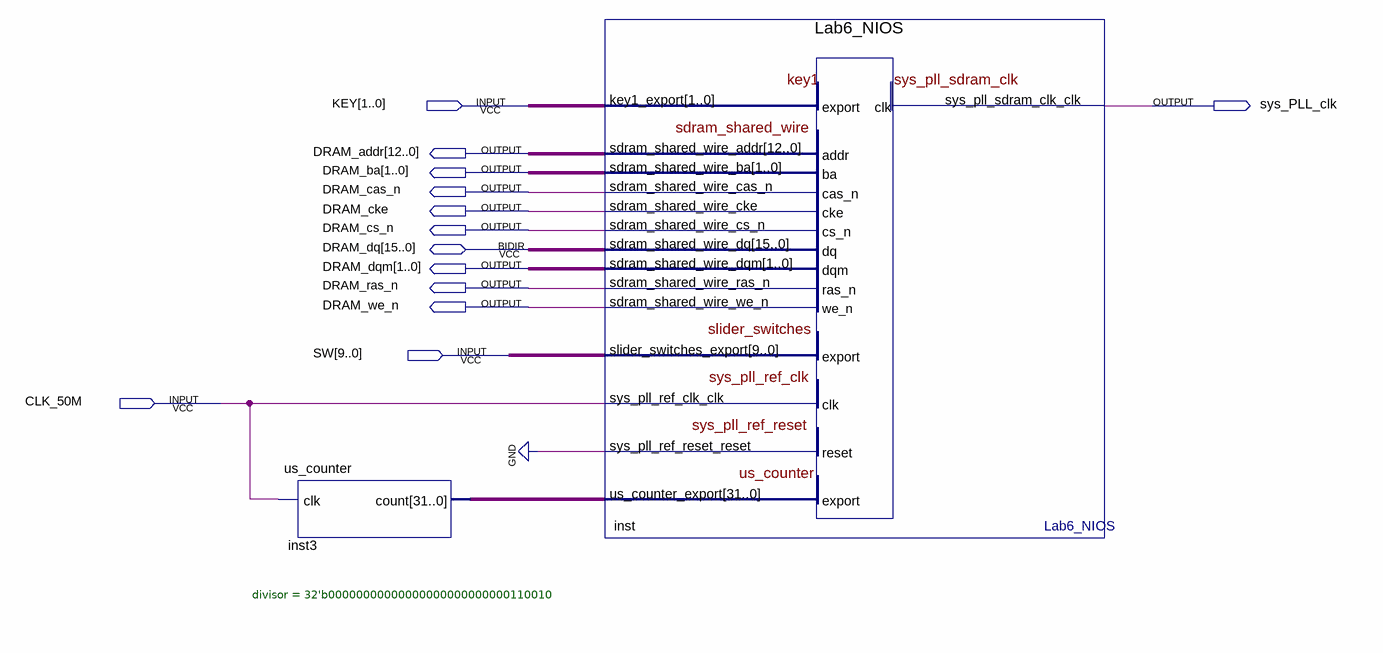
[diagram p0: schematic sheet]
// Quartus schematic Lab6.bdf as structural Verilog: 2 symbols, 13 pins
module Lab6 (
  input  [1:0] KEY,
  input  [9:0] SW,
  input  CLK_50M,
  inout  [15:0] DRAM_dq,
  output sys_PLL_clk,
  output [12:0] DRAM_addr,
  output [1:0] DRAM_ba,
  output DRAM_cas_n,
  output DRAM_cke,
  output DRAM_cs_n,
  output [1:0] DRAM_dqm,
  output DRAM_ras_n,
  output DRAM_we_n
);

  wire [31:0] inst3_count;

  us_counter #(.divisor(32'b00000000000000000000000000110010)) inst3 (.clk(CLK_50M), .count(inst3_count));
  Lab6_NIOS inst (
    .key1_export(KEY), .slider_switches_export(SW), .sys_pll_ref_clk_clk(CLK_50M),
    .sys_pll_ref_reset_reset(1'b0), .us_counter_export(inst3_count), .sdram_shared_wire_addr(DRAM_addr),
    .sdram_shared_wire_ba(DRAM_ba), .sdram_shared_wire_cas_n(DRAM_cas_n), .sdram_shared_wire_cke(DRAM_cke),
    .sdram_shared_wire_cs_n(DRAM_cs_n), .sdram_shared_wire_dqm(DRAM_dqm),
    .sdram_shared_wire_ras_n(DRAM_ras_n), .sdram_shared_wire_we_n(DRAM_we_n),
    .sys_pll_sdram_clk_clk(sys_PLL_clk), .sdram_shared_wire_dq(DRAM_dq));
endmodule
